# EAGLE design esperto_v1 (EAGLE 8.4.3)
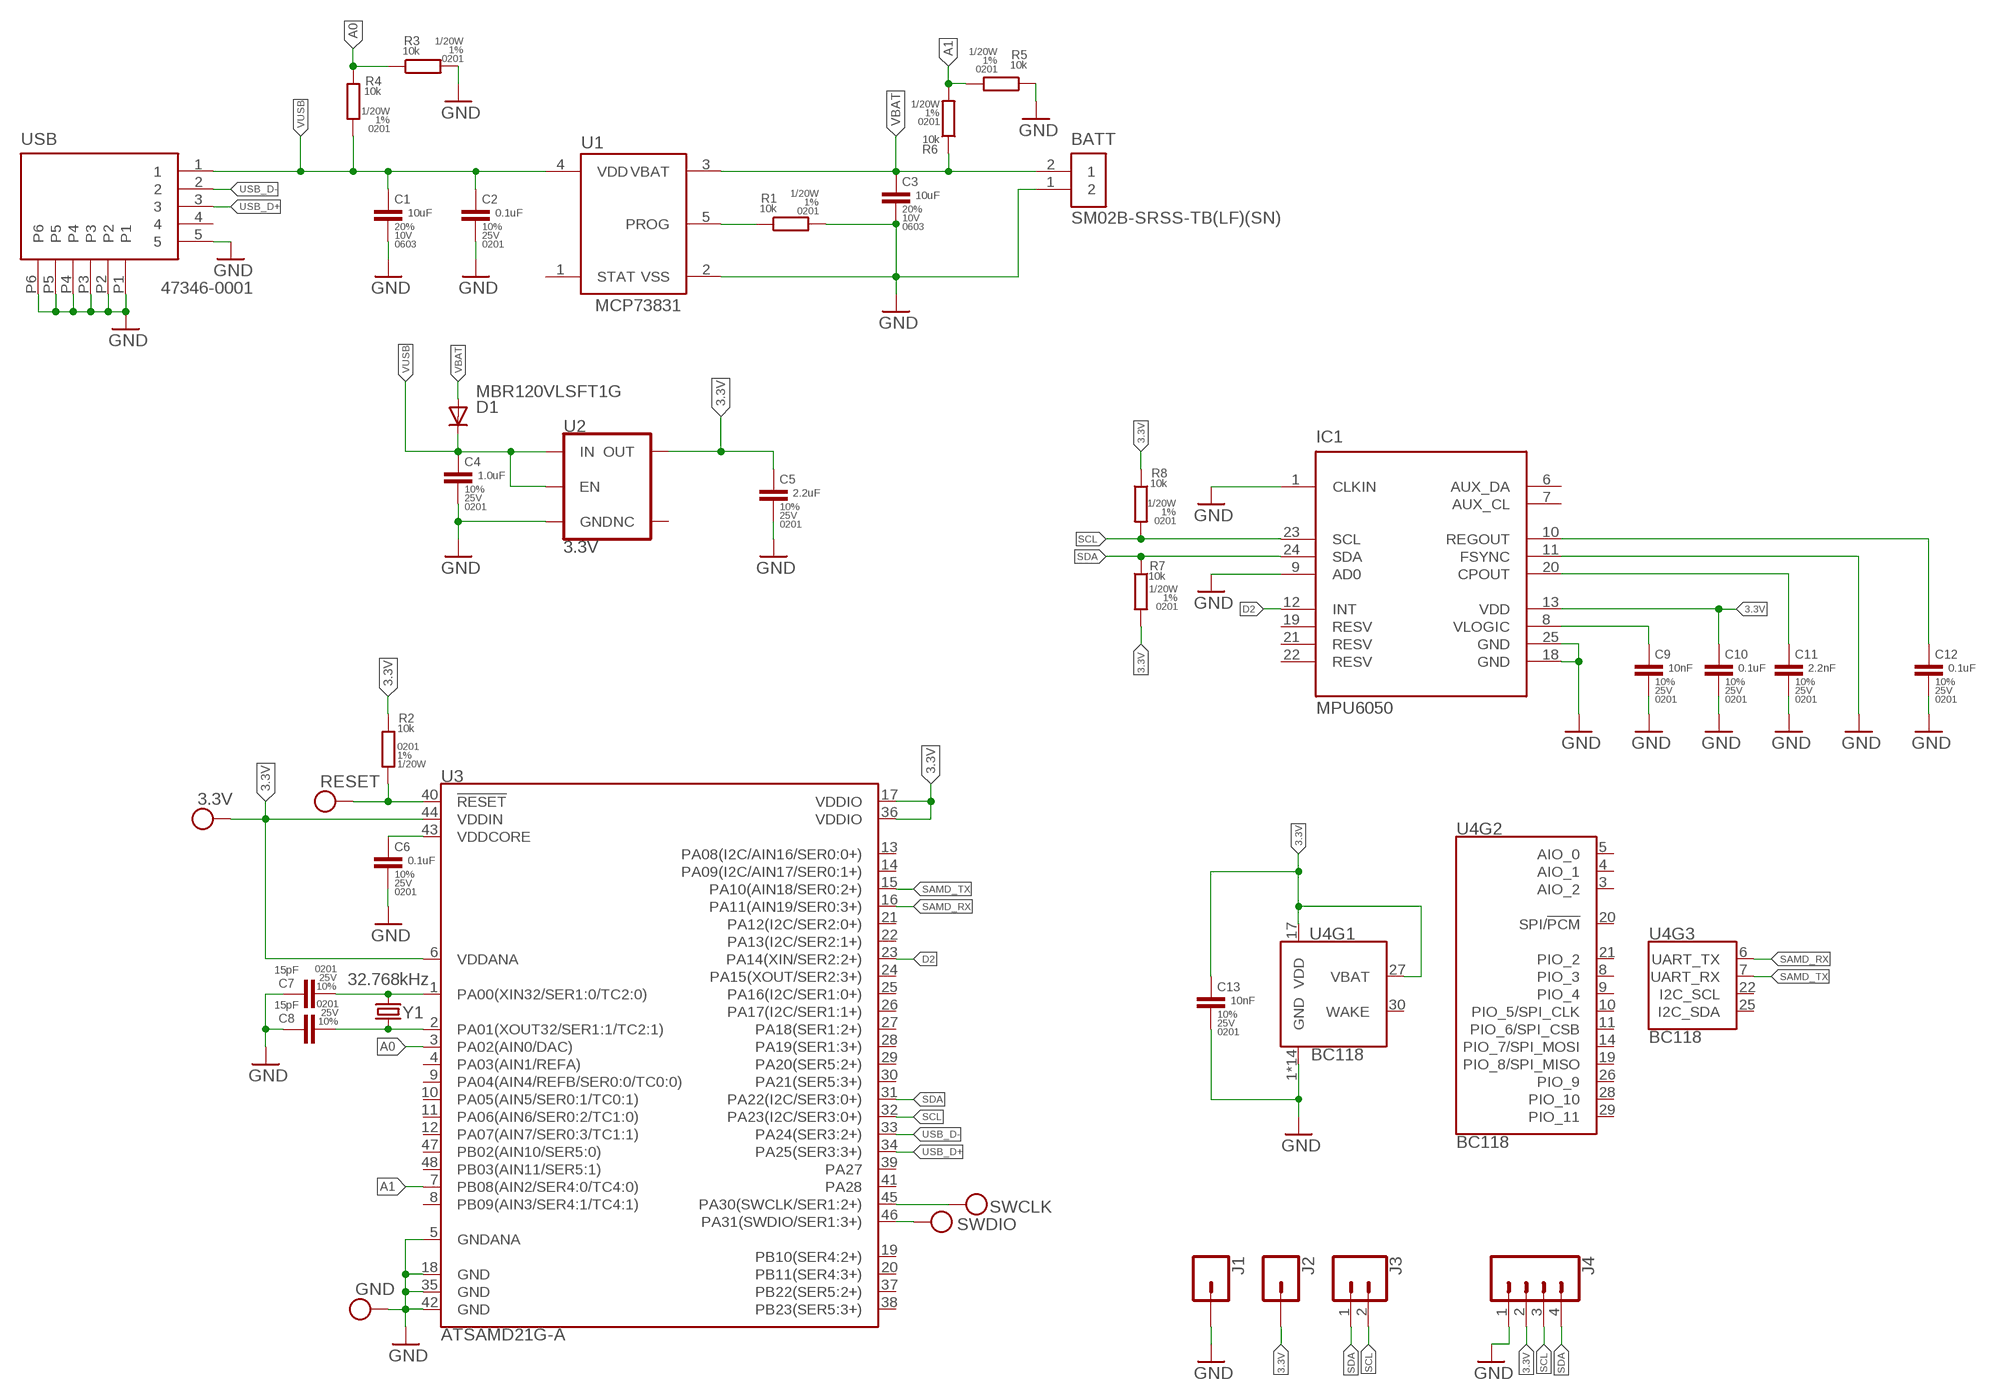
[diagram p0: schematic, sheet 1]

## Parts
3.3V  PIN_1X.05"1  [1X.05"]
BATT  SM02B-SRSS-TB(LF)(SN)  AS-ITM-00231  [JST_SH_2X1]
C1  10uF  C-EUC0603_MURATA_GRM18  [C0603_MURATA_GRM18]
C2  0.1uF  C-EUC0201_MURATA_GRM03  [C0201_MURATA_GRM03]
C3  10uF  C-EUC0603_MURATA_GRM18  [C0603_MURATA_GRM18]
C4  1.0uF  C-EUC0201_MURATA_GRM03  [C0201_MURATA_GRM03]
C5  2.2uF  C-EUC0201_MURATA_GRM03  [C0201_MURATA_GRM03]
C6  0.1uF  C-EUC0201_MURATA_GRM03  [C0201_MURATA_GRM03]
C7  15pF  C-EUC0201_MURATA_GRM03  [C0201_MURATA_GRM03]
C8  15pF  C-EUC0201_MURATA_GRM03  [C0201_MURATA_GRM03]
C9  10nF  C-EUC0201_MURATA_GRM03  [C0201_MURATA_GRM03]
C10  0.1uF  C-EUC0201_MURATA_GRM03  [C0201_MURATA_GRM03]
C11  2.2nF  C-EUC0201_MURATA_GRM03  [C0201_MURATA_GRM03]
C12  0.1uF  C-EUC0201_MURATA_GRM03  [C0201_MURATA_GRM03]
C13  10nF  C-EUC0201_MURATA_GRM03  [C0201_MURATA_GRM03]
D1  MBR120VLSFT1G  AS-ITM-00111  [SOD-123FL]
GND  PIN_1X.05"1  [1X.05"]
IC1  MPU6050  [QFN50P400X400X95-25T265X275N]
J1  CONN_01  [1X01]
J2  CONN_01  [1X01]
J3  CONN_02  [1X02]
J4  CONN_04  [1X04]
R1  10k  R-EU_R0201_VISHAY_CRCW0201  [R0201_VISHAY_CRCW0201]
R2  10k  R-EU_R0201_VISHAY_CRCW0201  [R0201_VISHAY_CRCW0201]
R3  10k  R-EU_R0201_VISHAY_CRCW0201  [R0201_VISHAY_CRCW0201]
R4  10k  R-EU_R0201_VISHAY_CRCW0201  [R0201_VISHAY_CRCW0201]
R5  10k  R-EU_R0201_VISHAY_CRCW0201  [R0201_VISHAY_CRCW0201]
R6  10k  R-EU_R0201_VISHAY_CRCW0201  [R0201_VISHAY_CRCW0201]
R7  10k  R-EU_R0201_VISHAY_CRCW0201  [R0201_VISHAY_CRCW0201]
R8  10k  R-EU_R0201_VISHAY_CRCW0201  [R0201_VISHAY_CRCW0201]
RESET  PIN_1X.05"1  [1X.05"]
SWCLK  PIN_1X.05"1  [1X.05"]
SWDIO  PIN_1X.05"1  [1X.05"]
U1  MCP73831  AS-ITM-00136  [SOT-23]
U2  3.3V  V_REG_AP2112K-3.3V  [SOT23-5]
U3  ATSAMD21G-A  [TQFP-48]
U4  BC118  [BC118]
USB  47346-0001  AS-ITM-00021  [MICRO_USB]
Y1  32.768kHz  CRYSTAL-32.768KHZSMD-3.2X1.5  [CRYSTAL-SMD-3.2X1.5MM]

## Nets
3.3V: 3.3V.1 C5.1 C10.1 C13.1 IC1.13(VDD) J2.1 J4.2 R2.1 R7.2 R8.1 U2.5(OUT) U3.6(VDDANA) U3.17(VDDIO) U3.36(VDDIO) U3.44(VDDIN) U4.17(VDD) U4.27(VBAT)
A0: R3.1 R4.1 U3.3(PA02(AIN0/DAC))
A1: R5.2 R6.2 U3.7(PB08(AIN2/SER4:0/TC4:0))
D2: IC1.12(INT) U3.23(PA14(XIN/SER2:2+))
GND: BATT.1 C1.2 C2.2 C3.2 C4.2 C5.2 C6.2 C7.1 C8.1 C9.2 C10.2 C11.2 C12.2 C13.2 GND.1 IC1.1(CLKIN) IC1.9(AD0) IC1.11(FSYNC) IC1.18(GND) IC1.25(GND) J1.1 J4.1 R1.2 R3.2 R5.1 U1.2(VSS) U2.2(GND) U3.5(GNDANA) U3.18(GND) U3.35(GND) U3.42(GND) U4.1(GND) U4.2(GND) U4.12(GND) U4.13(GND) U4.15(GND) U4.16(GND) U4.18(GND) U4.23(GND) U4.24(GND) U4.31(GND) U4.32(GND) U4.33(GND) U4.34(GND) U4.35(GND) USB.5 USB.P1 USB.P2 USB.P3 USB.P4 USB.P5 USB.P6
N$2: R1.1 U1.5(PROG)
N$3: R2.2 RESET.1 U3.40(!RESET!)
N$4: C6.1 U3.43(VDDCORE)
N$5: C7.2 U3.1(PA00(XIN32/SER1:0/TC2:0)) Y1.P$1
N$6: C8.2 U3.2(PA01(XOUT32/SER1:1/TC2:1)) Y1.P$2
N$7: SWCLK.1 U3.45(PA30(SWCLK/SER1:2+))
N$8: SWDIO.1 U3.46(PA31(SWDIO/SER1:3+))
N$9: C9.1 IC1.8(VLOGIC)
N$10: C11.1 IC1.20(CPOUT)
N$11: C12.1 IC1.10(REGOUT)
SAMD_RX: U3.16(PA11(AIN19/SER0:3+)) U4.6(UART_TX)
SAMD_TX: U3.15(PA10(AIN18/SER0:2+)) U4.7(UART_RX)
SCL: IC1.23(SCL) J3.2 J4.3 R8.2 U3.32(PA23(I2C/SER3:0+))
SDA: IC1.24(SDA) J3.1 J4.4 R7.1 U3.31(PA22(I2C/SER3:0+))
USB_D+: U3.34(PA25(SER3:3+)) USB.3
USB_D-: U3.33(PA24(SER3:2+)) USB.2
VBAT: BATT.2 C3.1 D1.A R6.1 U1.3(VBAT)
VUSB: C1.1 C2.1 C4.1 D1.C R4.2 U1.4(VDD) U2.1(IN) U2.3(EN) USB.1
Unconnected: IC1.2(NC) IC1.3(NC) IC1.4(NC) IC1.5(NC) IC1.6(AUX_DA) IC1.7(AUX_CL) IC1.14(NC) IC1.15(NC) IC1.16(NC) IC1.17(NC) IC1.19(RESV) IC1.21(RESV) IC1.22(RESV) U1.1(STAT) U2.4(NC) U3.4(PA03(AIN1/REFA)) U3.8(PB09(AIN3/SER4:1/TC4:1)) U3.9(PA04(AIN4/REFB/SER0:0/TC0:0)) U3.10(PA05(AIN5/SER0:1/TC0:1)) U3.11(PA06(AIN6/SER0:2/TC1:0)) U3.12(PA07(AIN7/SER0:3/TC1:1)) U3.13(PA08(I2C/AIN16/SER0:0+)) U3.14(PA09(I2C/AIN17/SER0:1+)) U3.19(PB10(SER4:2+)) U3.20(PB11(SER4:3+)) U3.21(PA12(I2C/SER2:0+)) U3.22(PA13(I2C/SER2:1+)) U3.24(PA15(XOUT/SER2:3+)) U3.25(PA16(I2C/SER1:0+)) U3.26(PA17(I2C/SER1:1+)) U3.27(PA18(SER1:2+)) U3.28(PA19(SER1:3+)) U3.29(PA20(SER5:2+)) U3.30(PA21(SER5:3+)) U3.37(PB22(SER5:2+)) U3.38(PB23(SER5:3+)) U3.39(PA27) U3.41(PA28) U3.47(PB02(AIN10/SER5:0)) U3.48(PB03(AIN11/SER5:1)) U4.3(AIO_2) U4.4(AIO_1) U4.5(AIO_0) U4.8(PIO_3) U4.9(PIO_4) U4.10(PIO_5/SPI_CLK) U4.11(PIO_6/SPI_CSB) U4.14(PIO_7/SPI_MOSI) U4.19(PIO_8/SPI_MISO) U4.20(SPI/!PCM) U4.21(PIO_2) U4.22(I2C_SCL) U4.25(I2C_SDA) U4.26(PIO_9) U4.28(PIO_10) U4.29(PIO_11) U4.30(WAKE) USB.4

## Library data of the parts
3.3V GND RESET SWCLK SWDIO = tinycircuits:PIN_1X.05": 1 Pin 0.05" Header
BATT = tinycircuits:AS-ITM-00231: CONN HEADER SH 2POS SIDE 1MM; PARTNO: AS-ITM-00231; PNPROTATION: 180
C1 C3 = CAPACITOR:C-EU: CAPACITOR, European symbol; PACKAGE: 0603; RATING: 10V; TOLERANCE: 20%
C2 C4-C13 = CAPACITOR:C-EU: CAPACITOR, European symbol; PACKAGE: 0201; RATING: 25V; TOLERANCE: 10%
D1 = tinycircuits:AS-ITM-00111: DIODE SCHOTTKY 20V 1A SOD123L; PARTNO: AS-ITM-00111
IC1 = invensense:MPU6050: The triple-axis MEMS gyroscope
J1 J2 = SparkFun-Connectors:CONN_01: Single connection point. Often used as Generic Header-pin footprint for 0.1 inch spaced/style header connections On any of the 0.1 inch spaced packages, you can populate with these: Break Away Headers - Straight <https://www.sparkfun.com/products/116> (PRT-00116) Break Away Male Headers - Right Angle <https://www.sparkfun.com/products/553> (PRT-00553) Female Headers <https://www.sparkfun.com/products/115> (PRT-00115) Break Away Headers - Machine Pin <https://www.sparkfun.com/products/117> (PRT-00117) Break Away Female Headers - Swiss Machine Pin <https://www.sparkfun.com/products/743> (PRT-00743) This device is also useful as a general connection point to wire up your design to another part of your project. Our various solder wires solder well into these plated through hole pads. Hook-Up Wire - Assortment (Stranded, 22 AWG) <https://www.sparkfun.com/products/11375> (PRT-11375) Hook-Up Wire - Assortment (Solid Core, 22 AWG) <https://www.sparkfun.com/products/11367> (PRT-11367) View the entire wire category on our website here <https://www.sparkfun.com/categories/141> Special notes: SMTSO-256-ET is a "flush mount" nut for a 4-40 screw. We mostly use this on specialty testbeds; it is a nice way to connect hardware to your PCB at an adjustable hieght. Also note, the SNAP packages are for using a snappable style connector. We sell a baggie of snaps and they are also used on two LilyPad designs: Snap Assortment - 30 pack (male and female) <https://www.sparkfun.com/products/11347> (DEV-11347) LilyPad Arduino SimpleSnap <https://www.sparkfun.com/products/10941> (DEV-10941) LilyPad SimpleSnap Protoboard <https://www.sparkfun.com/products/10940> (DEV-10940)
J3 = SparkFun-Connectors:CONN_02: Multi connection point. Often used as Generic Header-pin footprint for 0.1 inch spaced/style header connections On any of the 0.1 inch spaced packages, you can populate with these: Break Away Headers - Straight <https://www.sparkfun.com/products/116> (PRT-00116) Break Away Male Headers - Right Angle <https://www.sparkfun.com/products/553> (PRT-00553) Female Headers <https://www.sparkfun.com/products/115> (PRT-00115) Break Away Headers - Machine Pin <https://www.sparkfun.com/products/117> (PRT-00117) Break Away Female Headers - Swiss Machine Pin <https://www.sparkfun.com/products/743> (PRT-00743) For SCREWTERMINALS and SPRING TERMINALS visit here: Screw Terimnals on SparkFun.com <https://www.sparkfun.com/search/results?term=Screw+Terminals> (5mm/3.5mm/2.54mm spacing) This device is also useful as a general connection point to wire up your design to another part of your project. Our various solder wires solder well into these plated through hole pads. Hook-Up Wire - Assortment (Stranded, 22 AWG) <https://www.sparkfun.com/products/11375> (PRT-11375) Hook-Up Wire - Assortment (Solid Core, 22 AWG) <https://www.sparkfun.com/products/11367> (PRT-11367) View the entire wire category on our website here <https://www.sparkfun.com/categories/141> Special notes: Molex polarized connector foot print use with: PRT-08233 with associated crimp pins and housings. 2.54_SCREWTERM for use with PRT-10571. 3.5mm Screw Terminal footprints for PRT-08084 5mm Screw Terminal footprints for use with PRT-08432
J4 = SparkFun-Connectors:CONN_04: Multi connection point. Often used as Generic Header-pin footprint for 0.1 inch spaced/style header connections On any of the 0.1 inch spaced packages, you can populate with these: Break Away Headers - Straight <https://www.sparkfun.com/products/116> (PRT-00116) Break Away Male Headers - Right Angle <https://www.sparkfun.com/products/553> (PRT-00553) Female Headers <https://www.sparkfun.com/products/115> (PRT-00115) Break Away Headers - Machine Pin <https://www.sparkfun.com/products/117> (PRT-00117) Break Away Female Headers - Swiss Machine Pin <https://www.sparkfun.com/products/743> (PRT-00743) For SCREWTERMINALS and SPRING TERMINALS visit here: Screw Terimnals on SparkFun.com <https://www.sparkfun.com/search/results?term=Screw+Terminals> (5mm/3.5mm/2.54mm spacing) This device is also useful as a general connection point to wire up your design to another part of your project. Our various solder wires solder well into these plated through hole pads. Hook-Up Wire - Assortment (Stranded, 22 AWG) <https://www.sparkfun.com/products/11375> (PRT-11375) Hook-Up Wire - Assortment (Solid Core, 22 AWG) <https://www.sparkfun.com/products/11367> (PRT-11367) View the entire wire category on our website here <https://www.sparkfun.com/categories/141> Special notes: Molex polarized connector foot print use with SKU : PRT-08231 with associated crimp pins and housings. 1MM SMD Version SKU: PRT-10208; PROD_ID: CONN-09696
R1-R8 = RESISTOR:R-EU_: RESISTOR, European symbol; PACKAGE: 0201; RATING: 1/20W; TOLERANCE: 1%
U1 = tinycircuits:AS-ITM-00136: IC CONTROLLER LI-ION 4.2V SOT23-5; PARTNO: AS-ITM-00136; PNPROTATION: 270
U2 = SparkFun-IC-Power:V_REG_AP2112: AP2112 - 600mA CMOS LDO Regulator w/ Enable The AP2112 is CMOS process low dropout linear regulator with enable function, the regulator delivers a guaranteed 600mA (min.) continuous load current. Features Output Voltage Accuracy: ±1.5% Output Current: 600mA (Min.) Foldback Short Current Protection: 50mA Enable Function to Turn ON/OFF VOUT Low Dropout Voltage (3.3V): 250mV (Typ.) @IOUT=600mA Excellent Load Regulation: 0.2%/A (Typ.) Excellent Line Regulation: 0.02%/V (Typ.) Low Quiescent Current: 55μA (Typ.) Low Standby Current: 0.01μA (Typ.) Low Output Noise: 50μVRMS PSRR: 100Hz -65dB, 1kHz -65dB OTSD Protection Stable with 1.0μF Flexible Cap: Ceramic, Tantalum and Aluminum Electrolytic Operation Temperature Range: -40°C to 85°C ESD: MM 400V, HBM 4000V; PROD_ID: VREG-12457
U3 = SparkFun-IC-Microcontroller:ATSAMD21G: Atmel SAMD21G SMART ARM-Based Microcontroller The Atmel ® | SMART ™ SAM D21 is a series of low-power microcontrollers using the 32-bit ARM ® Cortex ® -M0+ processor, and ranging from 32- to 64-pins with up to 256KB Flash and 32KB of SRAM. The SAM D21 devices operate at a maximum frequency of 48MHz and reach 2.46 CoreMark/MHz. They are designed for simple and intuitive migration with identical peripheral modules, hex compatible code, identical linear address map and pin compatible migration paths between all devices in the product series. All devices include intelligent and flexible peripherals, Atmel Event System for inter-peripheral signaling, and support for capacitive touch button, slider and wheel user interfaces. Datasheet <https://cdn.sparkfun.com/datasheets/Dev/Arduino/Boards/Atmel-42181-SAM-D21_Datasheet.pdf> SparkFun Products SparkFun SAMD21 Mini Breakout <https://www.sparkfun.com/products/13664> (DEV-13664) SparkFun SAMD21 Dev Breakout <https://www.sparkfun.com/products/13672> (DEV-13672); PROD_ID: IC-13064
U4 = SparkFun-RF:BC118: Blue Creation BC118 Bluetooth 4.0 Audio Module BC118 consists of a Bluetooth Smart (Bluetooth 4.0) radio, a microprocessor running an embedded protocol stack. The module is controlled by high level UART instructions or GPIOs. B118 supports UART and I2C Transparent mode for cable replacement, standard/custom profiles, central and peripheral modes. It can connect to any Android, iOS or Windows Mobile Smartphone that is Bluetooth smart capable. The firmware can be upgraded using an App provided by BlueCreation. BC118 can run standalone, with a host processor or controlled by an App. Datasheet <http://media.digikey.com/pdf/Data%20Sheets/BlueCreation%20PDFs/BC118_DS.pdf> SparkFun Products: BLE Mate 2 <https://www.sparkfun.com/products/13019> (WRL-13019); PROD_ID: WRL-12203
USB = tinycircuits:AS-ITM-00021: CONN RCPT 5POS MICRO USB R/A; PARTNO: AS-ITM-00021; PNPROTATION: 90
Y1 = SparkFun-Clocks:CRYSTAL-32.768KHZ: 32.768kHz Crystal Frequency: 32.768kHz Frequency Stability: ±20ppm Load Capacitance: 12.5pF (PTH-2X6 & SMD-3.2X1.5), 6pF (SMD-2X6) SparkFun Products: SparkFun BigTime Watch Kit <https://www.sparkfun.com/products/11734> SparkFun nRF52832 Breakout <https://www.sparkfun.com/products/13990> SparkFun Real Time Clock Module <https://www.sparkfun.com/products/12708>; PROD_ID: XTAL-13062

## Board
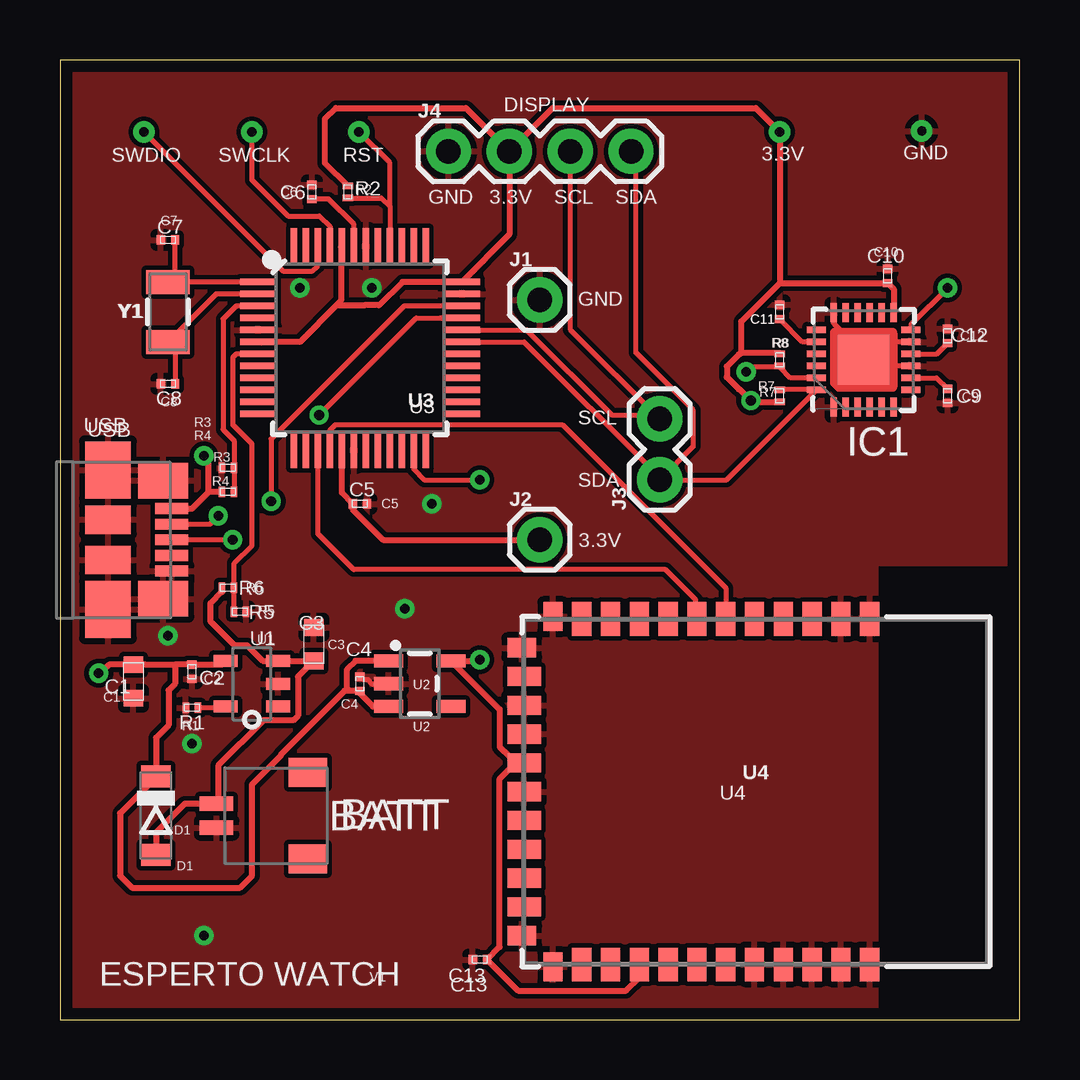
[diagram p1: board, top side]
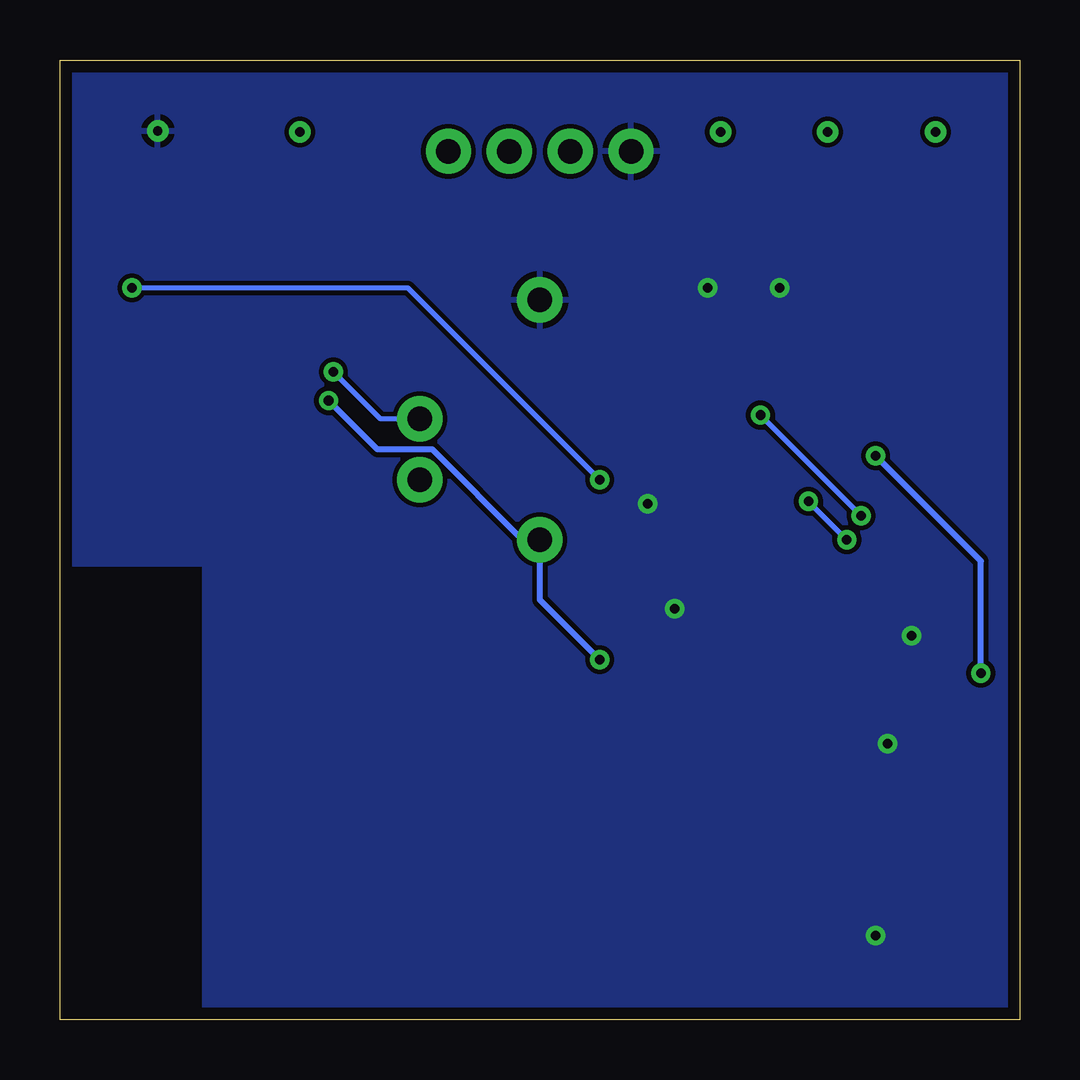
[diagram p2: board, bottom side, seen from below]

Size 40 x 40 mm. Coordinates in mm from the lower left corner, seen from the top.
Outline: 0,0 40,0 40,40 0,40 0,0
Copper layers (1*16): Top 0.035mm / dielectric 1.5mm / Bottom 0.035mm
Design rules "default *": minimum track width 0.2mm, minimum drill 0.4mm, track to track 0.2mm, track to pad 0.2mm, pad to pad 0.2mm, via to via 0.2mm, smd to smd 0mil, copper to edge 0.5mm, drill to drill 0.4mm, minimum pad ring 0.1mm, minimum via ring 0.2mm, stop-mask expansion 4mil, vias tented up to drill 0mil, thermal gap 10mil

### Footprints (pad centres in the part's own frame; a part is rotated, then mirrored left to right if it is on the bottom)
1X.05" = drill 0.381 pad 0.889: 1 0,0
JST_SH_2X1 = smd 0.6 x 1.4: 1 -0.5,2.475; 2 0.5,2.475 | smd 1.2 x 1.6: PAD1 -1.8,-1.325; PAD2 1.8,-1.325
C0603_MURATA_GRM18 = smd 0.7 x 0.8: 1 -0.7,0; 2 0.7,0
C0201_MURATA_GRM03 = smd 0.35 x 0.4: 1 -0.3,0; 2 0.3,0
SOD-123FL = smd 0.914 x 1.219: A 1.638,0; C -1.638,0
QFN50P400X400X95-25T265X275N = smd 0.26 x 0.79: 1 -1.25,-1.97; 2 -0.75,-1.97; 3 -0.25,-1.97; 4 0.25,-1.97; 5 0.75,-1.97; 6 1.25,-1.97; 13 1.25,1.97; 14 0.75,1.97; 15 0.25,1.97; 16 -0.25,1.97; 17 -0.75,1.97; 18 -1.25,1.97 | smd 0.79 x 0.26: 7 1.97,-1.25; 8 1.97,-0.75; 9 1.97,-0.25; 10 1.97,0.25; 11 1.97,0.75; 12 1.97,1.25; 19 -1.97,1.25; 20 -1.97,0.75; 21 -1.97,0.25; 22 -1.97,-0.25; 23 -1.97,-0.75; 24 -1.97,-1.25 | smd 2.15 x 2.05: 25 0,0
1X01 = drill 1.016 pad 1.88: 1 0,0
1X02 = drill 1.016 pad 1.88: 1 0,0; 2 2.54,0
1X04 = drill 1.016 pad 1.88: 1 0,0; 2 2.54,0; 3 5.08,0; 4 7.62,0
R0201_VISHAY_CRCW0201 = smd 0.28 x 0.43: 1 -0.255,0; 2 0.255,0
SOT-23 = smd 0.5 x 1: 1 -0.95,-1.1; 2 0,-1.1; 3 0.95,-1.1; 4 0.95,1.1; 5 -0.95,1.1
SOT23-5 = smd 0.55 x 1.2: 1 -0.95,-1.3; 2 0,-1.3; 3 0.95,-1.3; 4 0.95,1.3; 5 -0.95,1.3
TQFP-48 = smd 1.5 x 0.28: 1 -4.25,2.75; 2 -4.25,2.25; 3 -4.25,1.75; 4 -4.25,1.25; 5 -4.25,0.75; 6 -4.25,0.25; 7 -4.25,-0.25; 8 -4.25,-0.75; 9 -4.25,-1.25; 10 -4.25,-1.75; 11 -4.25,-2.25; 12 -4.25,-2.75; 25 4.25,-2.75; 26 4.25,-2.25; 27 4.25,-1.75; 28 4.25,-1.25; 29 4.25,-0.75; 30 4.25,-0.25; 31 4.25,0.25; 32 4.25,0.75; 33 4.25,1.25; 34 4.25,1.75; 35 4.25,2.25; 36 4.25,2.75 | smd 0.28 x 1.5: 13 -2.75,-4.25; 14 -2.25,-4.25; 15 -1.75,-4.25; 16 -1.25,-4.25; 17 -0.75,-4.25; 18 -0.25,-4.25; 19 0.25,-4.25; 20 0.75,-4.25; 21 1.25,-4.25; 22 1.75,-4.25; 23 2.25,-4.25; 24 2.75,-4.25; 37 2.75,4.25; 38 2.25,4.25; 39 1.75,4.25; 40 1.25,4.25; 41 0.75,4.25; 42 0.25,4.25; 43 -0.25,4.25; 44 -0.75,4.25; 45 -1.25,4.25; 46 -1.75,4.25; 47 -2.25,4.25; 48 -2.75,4.25
BC118 = smd 1.4 x 0.8: 1 -7.2,4.75; 2 -7.2,3.55; 3 -7.2,2.35; 4 -7.2,1.15; 5 -7.2,-0.05; 6 -7.2,-1.25; 7 -7.2,-2.45; 8 -7.2,-3.65; 9 -7.2,-4.85; 10 -7.2,-6.05; 11 -7.2,-7.25; 25 7.2,-7.25; 26 7.2,-6.05; 27 7.2,-4.85; 28 7.2,-3.65; 29 7.2,-2.45; 30 7.2,-1.25; 31 7.2,-0.05; 32 7.2,1.15; 33 7.2,2.35; 34 7.2,3.55; 35 7.2,4.75 | smd 1.2 x 0.8: 12 -7.3,-8.45; 24 7.3,-8.45 | smd 0.8 x 1.2: 13 -6,-9.75; 23 6,-9.75 | smd 0.8 x 1.4: 14 -4.8,-9.65; 15 -3.6,-9.65; 16 -2.4,-9.65; 17 -1.2,-9.65; 18 0,-9.65; 19 1.2,-9.65; 20 2.4,-9.65; 21 3.6,-9.65; 22 4.8,-9.65
MICRO_USB = smd 1.38 x 0.45: 1 2.66,1.3; 2 2.66,0.65; 3 2.66,0; 4 2.66,-0.65; 5 2.66,-1.3 | smd 2.1 x 1.475: P1 2.3,-2.462; P2 2.3,2.462 | smd 1.9 x 2.375: P3 0,2.913; P4 0,-2.913 | smd 1.9 x 1.175: P5 0,0.838; P6 0,-0.838
CRYSTAL-SMD-3.2X1.5MM = smd 1 x 1.8: P$1 -1.25,0; P$2 1.25,0

### Placement (x,y rotation side)
3.3V  30,37 0 top
BATT  9,8.5 90 top
C1  3.06,14.09 270 top
C2  5.5,14.5 270 top
C3  10.58,15.65 90 top
C4  12.5,14 90 top
C5  12.5,21.5 0 top
C6  10.5,34.5 90 top
C7  4.5,32.5 0 top
C8  4.5,26.5 0 top
C9  37,26 270 top
C10  34.5,31 90 top
C11  30,29.5 90 top
C12  37,28.5 90 top
C13  17.5,2.5 180 top
D1  4,8.5 270 top
GND  35.92,37.04 0 top
IC1  33.5,27.5 0 top
J1  20,30 0 top
J2  20,20 0 top
J3  25,22.5 90 top
J4  16.19,36.19 0 top
R1  5.5,13 180 top
R2  12,34.5 270 top
R3  7,23 180 top
R4  7,22 180 top
R5  7.5,17 180 top
R6  7,18 0 top
R7  30,26 270 top
R8  30,27.5 270 top
RESET  12.46,37 0 top
SWCLK  8,37 0 top
SWDIO  3.5,37 0 top
U1  8,14 90 top
U2  15,14 270 top
U3  12.5,28 0 top
U4  29,9.5 270 top
USB  2,20 0 top
Y1  4.5,29.5 270 top

### Tracks (layer width: path | path; a pad name or v marks a point on that pad's centre or on a via)
3.3V  (via drill 0.4)
  Top 0.2: 24,1.8 24,2.2 U4.27 | 16.2,15 U2.5 | IC1.13 34.8,29.6 | 27.8,26.8 v28.8,25.8 | 30,27.8 R8.1 | U3.6 8.4,28.2 | 11.8,32.2 U3.44 | 18.8,36.2 J4.2 16.92,38 | 17.45,14.95 v17.5,15 | 18.8,10.8 19.2,10.8 U4.17 18.93,10.78 18.8,10.8
  Top 0.254: U4.27 24.15,1.75 23.6,1.2 19.1,1.2 C13.1 18.32,3.02 18.32,10.04 18.93,10.64 18.93,10.78 18.54,11.17 18.52,11.17 18.32,11.37 18.32,12.93 U2.5 17.45,14.95 | J2.1 13.46,20 12.2,21.26 C5.1 11.75,21.95 U3.17 | 11.53,29.77 10,28.25 U3.6 | 11.53,29.77 12.7,29.77 13.3,29.77 14.28,30.75 U3.36 18.73,32.73 J4.2 20.54,38 29,38 3.3V.1 30,30.7 | U3.44 11.72,32.22 11.72,29.97 11.53,29.77 | 18.8,36.2 J4.2 16.92,38 11.5,38 11.05,37.55 11.05,35.7 R2.1 | R7.2 28.86,25.75 v28.8,25.8 28.33,26.27 28.3,26.27 27.8,26.77 | 28.4,27.8 28.4,27.9 | 28.4,27.9 28.4,29.1 30,30.7 | 28.4,27.8 28.33,27.73 28.3,27.73 27.8,27.23 | 27.8,27.23 27.8,26.8 | 28.4,27.8 30,27.8 | IC1.13 34.75,30.45 C10.1 30,30.7 | 28.4,27.9 28.4,27.83 27.8,27.23
  Bottom 0.254: v17.5,15 20,17.5 J2.1 20.71,20 24.48,23.77 26.77,23.77 v28.8,25.8
A0
  Top 0.2: U3.3 7.35,29.75 6.8,29.2 6.8,24.6 7.25,24.14 7.25,22.91 | 7.25,22.91 R4.1 | 7.25,22.91 R3.1
A1
  Top 0.2: U3.7 7.35,27.75 7.2,27.6 7.2,24.8 8,24 8,19.76 7.26,19.02 7.26,18.01 R6.2 R5.2
D2  (via drill 0.4)
  Top 0.2: 35.6,28.8 IC1.12 35.47,28.97 v37,30.5 | v17.5,22.5 15.19,22.5 14.75,22.94 U3.23
  Bottom 0.2: v17.5,22.5 25.5,30.5 v37,30.5
GND  (via drill 0.4)
  Top 0.2: 33.6,27.4 34.5,27.4 34.65,27.25 IC1.9 | IC1.25 33.6,27.4 | 33.6,27.67 33.6,27.4 | 33.6,27.67 33.67,27.67 34.25,28.25 IC1.11 | IC1.18 32.25,29.02 33.6,27.67 | C4.2 12.62,14.18 12.82,14.18 13,14 U2.2
  other vias: 14.38,17.13 10,30.5 5.5,11.5 6,3.5 13,30.5 15.5,21.5 4.5,16
  pour Top: 0,40 40,40 40,19 34,19 34,0 0,0
  pour Bottom (rank 6): 0,40 40,40 40,19 34,19 34,0 0,0
N$2
  Top 0.2: R1.1 6.8,13 U1.5
N$3
  Top 0.2: 13.75,33.9 U3.40 | 13.75,33.9 13.75,35.71 RESET.1 | R2.2 13.4,34.24 13.75,33.9
N$4
  Top 0.2: C6.1 11.2,34.2 12.25,33.15 U3.43
N$5
  Top 0.2: C7.2 4.8,31 4.6,30.8 | 4.6,30.8 Y1.P$1 | U3.1 4.65,30.75 4.6,30.8
N$6
  Top 0.2: C8.2 4.8,28 4.6,28.2 Y1.P$2 6.5,30.25 U3.2
N$7
  Top 0.2: SWCLK.1 8,35 9.5,33.5 10.81,33.5 11.25,33.06 U3.45
N$8
  Top 0.2: U3.46 10.75,31.44 10.51,31.2 9.3,31.2 SWDIO.1
N$9
  Top 0.2: IC1.8 36.55,26.75 C9.1
N$10
  Top 0.2: IC1.20 30.95,28.25 C11.1
N$11
  Top 0.2: IC1.10 36.55,27.75 C12.1
SAMD_RX
  Top 0.2: U4.6 27.75,18 20.95,24.8 11.49,24.8 11.25,24.56 U3.16
SAMD_TX
  Top 0.2: U4.7 26.5,16.75 26.5,17.5 25.24,18.76 12.24,18.76 10.75,20.25 U3.15
SCL  (via drill 0.4)
  Top 0.2: 30,27.2 28.8,27.2 v28.6,27 | 30,27.2 R8.2 | J4.3 21.27,28.77 J3.2 25,25.2 23,25.2 19.45,28.75 U3.32 | IC1.23 30.45,26.75 30,27.2
  Bottom 0.2: J3.2 26.64,25.04 v28.6,27
SDA
  Top 0.2: 30,26.2 R7.1 31.34,26.25 31.4,26.2 IC1.24 27.78,22.5 J3.1 | 24.8,22.8 25,22.6 J3.1 | J4.4 24,36 24,27.8 26.4,25.4 26.4,23.9 J3.1 | 24.8,22.8 J3.1 | U3.31 19.35,28.25 24.8,22.8
USB_D+  (via drill 0.4)
  Top 0.2: v7.2,20 USB.3 | v8.8,21.6 8.8,24.2 14.35,29.75 U3.34
  Bottom 0.2: v8.8,21.6 v7.2,20
USB_D-  (via drill 0.4)
  Top 0.2: 15.85,29.25 U3.33 14.85,29.25 v10.8,25.2 | USB.2 6.25,20.65 v6.6,21
  Bottom 0.2: v10.8,25.2 v6.6,21
VBAT
  Top 0.2: 6,9 BATT.2 6.6,9 | 4,7 D1.A
  Top 0.254: 6.6,9 6.6,10.59 8.48,12.47 9.73,12.47 9.93,12.66 9.93,14.29 C3.1 | BATT.2 5.2,9 4,7.8 4,7 | R6.1 6.75,17.82 6.28,17.35 6.28,16.59 7.27,15.6 7.8,15.6 8.45,14.95 U1.3 C3.1 | C3.1
VUSB  (via drill 0.4)
  Top 0.2: 13.6,13.2 U2.3 | 13.6,14.8 U2.1 | 6.8,22 R4.2 | D1.C 4,9.82
  Top 0.254: USB.1 5.5,21.3 6.2,22 | R4.2 6.2,22 | 6.2,22 6.2,23.3 v6,23.5 | 4.8,14.8 C2.1 6.75,14.8 U1.4 | 4.8,14.8 4.8,14 4.52,13.72 4.52,12.27 4,11.75 D1.C 4,10.1 2.5,8.6 2.5,6 3,5.5 7.5,5.5 8,6 8,9.8 9.2,11 | C4.1 12.4,13.7 13.05,13.05 U2.3 | U2.1 12.31,14.95 11.97,14.61 11.97,13.81 11.86,13.7 | 9.2,11 9.2,11.04 | C4.1 12.48,13.72 | 4.8,14.8 3.57,14.8 C1.1 2.07,14.79 v1.61,14.44 | 9.2,11 9.2,11.04 | 11.86,13.7 9.2,11.04 | C4.1 11.86,13.7
  Bottom 0.254: v1.61,14.44 1.61,19.11 v6,23.5

### Text on the board
_tsilk: DISPLAY | SWDIO | SWCLK | RST | 3.3V | GND | C6 | R2 | GND | 3.3V | SCL | SDA | C7 | C10 | GND | Y1 | C11 | C12 | R8 | C8 | R7 | C9 | USB | R4 | R3 | U3 | SCL | IC1 | SDA | C5 | 3.3V | R6 | R5 | U1 | C3 | C2 | U2 | C1 | C4 | R1 | BATT | U4 | D1 | V1 | C13 | ESPERTO WATCH